# Altium schematic sheet Power+RPI_conn.SchDoc
size A3
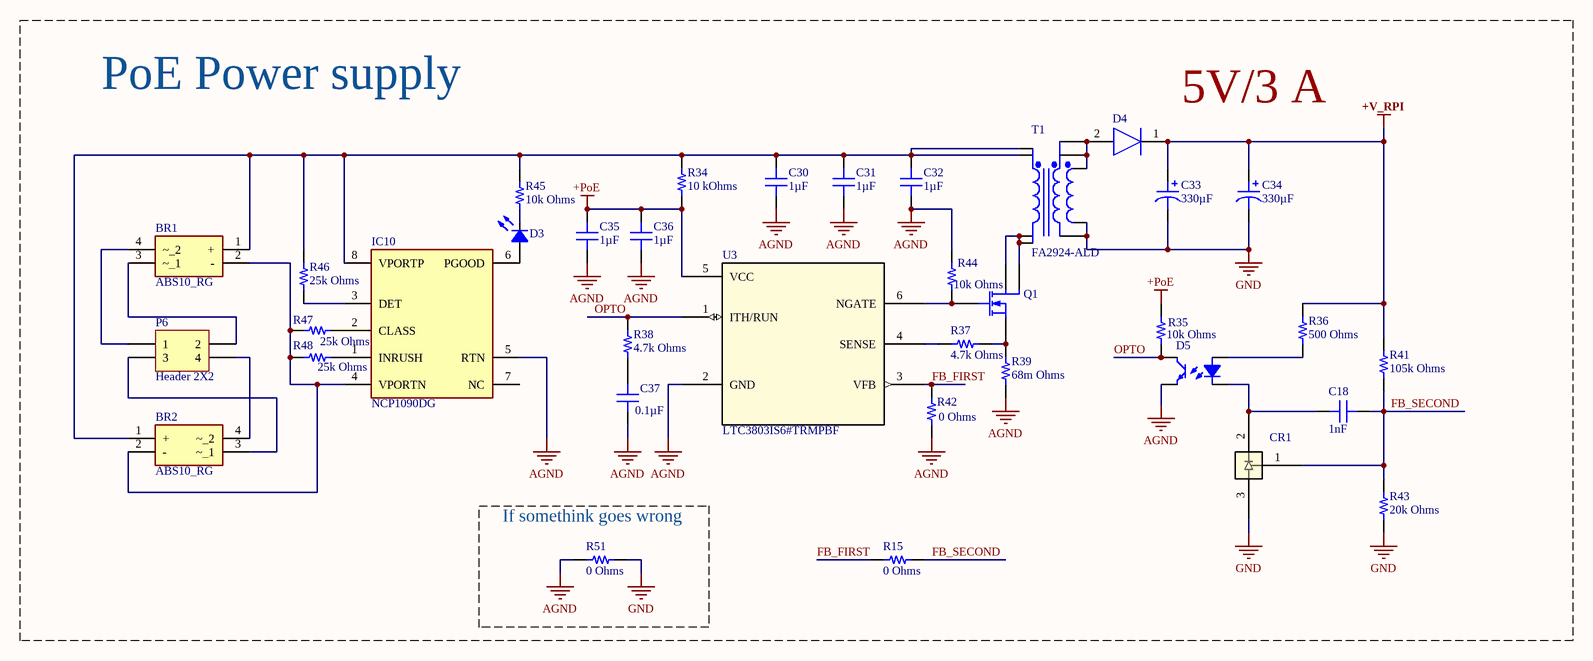
[diagram p0: Power+RPI_conn.SchDoc]

## Parts
BR1  ABS10_RG  [SOP400P645X160-4N]
BR2  ABS10_RG  [SOP400P645X160-4N]
C18  1nF  [CAP 0603_1608]
C30  1µF  [CAP 1206_3216 - 1.8MM]
C31  1µF  [CAP 1206_3216 - 1.8MM]
C32  1µF  [CAP 1206_3216 - 1.8MM]
C33  330µF  [CAP POL 2917_7343]
C34  330µF  [CAP POL 2917_7343]
C35  1µF  [CAP 1206_3216 - 1.8MM]
C36  1µF  [CAP 1206_3216 - 1.8MM]
C37  0.1µF  [CAP 0603_1608]
CR1  TLV431BFTA  [SOT23_DIO]  (value not drawn)
D3  (no value)  [LED 0603_1608 RED]
D4  SK56B_R4  [DIONM5236X261N]  (value not drawn)
D5  LTV-817S-TA1  [LITEON LTV-817]  (value not drawn)
IC10  NCP1090DG  [SOIC127P600X175-8N]
P6  Header 2X2  [HDR2X2]
Q1  IRFL4315TRPBF  [SOT230P700X180-4N]  (value not drawn)
R15  0 Ohms  [RES 2512_6432]
R34  10 kOhms  [RES 1206_3216]
R35  10k Ohms  [RES 0603_1608]
R36  500 Ohms  [RES 0603_1608]
R37  4.7k Ohms  [RES 0603_1608]
R38  4.7k Ohms  [RES 0603_1608]
R39  68m Ohms  [RES 1206_3216]
R41  105k Ohms  [RES 0603_1608]
R42  0 Ohms  [RES 0603_1608]
R43  20k Ohms  [RES 0603_1608]
R44  10k Ohms  [RES 0603_1608]
R45  10k Ohms  [RES 0603_1608]
R46  25k Ohms  [RES 0603_1608]
R47  25k Ohms  [RES 0603_1608]
R48  25k Ohms  [RES 0603_1608]
R51  0 Ohms  [RES 2512_6432]
T1  FA2924-ALD  [FA2924ALD]
U3  LTC3803IS6#TRMPBF  [SOT95P280X100-6N]

## Nets
+PoE: C35.2 C36.2 R34.1 R35.2 U3.5(VCC)
+V_RPI: C33.1 C34.1 D4.1(K) R36.2 R41.1
AGND: C30.1 C31.1 C32.1 C35.1 C36.1 C37.1 D5.3 IC10.5(RTN) R39.1 R42.2 R44.2 R51.1 U3.2(GND)
GND: C33.2 C34.2 CR1.3 R43.2 R51.2 T1.9(Sec-) T1.10(Sec-)
FB_FIRST: R15.1 R42.1 U3.3(VFB)
FB_SECOND: C18.1 CR1.1 R15.2 R41.2 R43.1
OPTO: D5.4 R35.1 R38.1 U3.1(ITH/RUN)
NetBR1_1: BR1.1(+) BR2.1(+) C30.2 C31.2 C32.2 IC10.8(VPORTP) R34.2 R45.1 R46.1 T1.1(Pri+) T1.5(Pri+)
NetBR1_2: BR1.2(-) BR2.2(-) IC10.4(VPORTN) R47.1 R48.1
NetBR1_3: BR1.3(~_1) P6.2
NetBR1_4: BR1.4(~_2) P6.1
NetBR2_3: BR2.3(~_1) P6.3
NetBR2_4: BR2.4(~_2) P6.4
NetC18_2: C18.2 CR1.2 D5.2
NetC37_2: C37.2 R38.2
NetD3_1: D3.1 IC10.6(PGOOD)
NetD3_2: D3.2 R45.2
NetD4_2: D4.2(A) T1.6(Sec+) T1.7(Sec+) T1.8(Sec+)
NetD5_1: D5.1 R36.1
NetIC10_1: IC10.1(INRUSH) R48.2
NetIC10_2: IC10.2(CLASS) R47.2
NetIC10_3: IC10.3(DET) R46.2
NetQ1_1: Q1.1(G) R44.1 U3.6(NGATE)
NetQ1_2: Q1.2(D) Q1.4(D_2) T1.2(Pri-) T1.3(Pri-)
NetQ1_3: Q1.3(S) R37.1 R39.2
NetR37_2: R37.2 U3.4(SENSE)

Not connected (* = marked no-connect by the designer): IC10 7(NC)

## Notes on the sheet
- PoE Power supply
- 5V/3 A
- (near R51) If somethink goes wrong

## Library data of the parts
BR1 BR2 = ABS10_RG: Bridge Rectifier; Manufacturer_Name: Taiwan Semiconductor; Manufacturer_Part_Number: ABS10 RG; Datasheet Link: http://210.6.198.34/ich_flag/www.taiwansemi.com/products/datasheet/ABS2 SERIES_L15.pdf; Height: 1.6mm; Arrow Part Number: ABS10 RG; Arrow Price/Stock: https://www.arrow.com/en/products/abs10rg/taiwan-semiconductor
C18 C37 = 100X14W104MV4T: CAP CER 0.1UF 10V X7R 0603; Part Number: 100X14W104MV4T
  C18: Value: 1nF
  C37: Value: 0.1µF
C30-C32 C35 C36 = C1206C105M1RACTU: CAP CER 1UF 100V X7R 1206; Manufacturer: KEMET; Tolerance: ±20%; Part Number: C1206C105M1RACTU; Value: 1µF; Applications: Bypass, Decoupling; Capacitance: 1µF; ComponentLink1Description: Datasheet; ComponentLink1URL: https://api.kemet.com/component-edge/download/datasheet/C1206C105M1RACTU.pdf; ComponentLink2Description: DigiKey Link; ComponentLink2URL: http://digikey.com/product-detail/en/kemet/C1206C105M1RACTU/399-11684-1-ND/5119827; Device Package: 1206 (3216 Metric); LastUpdated: 02/09/2020 01:05:39; Lifecycle Status: Active; Minimum Order: 1; Mounting Type: Surface Mount, MLCC; Operating Temperature: -55°C ~ 125°C; Package / Case: 1206 (3216 Metric); Packaging: TapeAndReel; PartId: 20380; Part Status: Active; Price: 0.13; Series: SMD Comm X7R; Size / Dimension: 0.126" L x 0.063" W (3.20mm x 1.60mm); Supplier 1: DigiKey; Supplier Part Number 1: 399-11684-1-ND; Temperature Coefficient: X7R; Thickness (Max): 0.071" (1.80mm); Voltage - Rated: 100V
C33 C34 = TPSE337M010R0060: CAP TANT 330UF 20% 10V 2917; Manufacturer: AVX Corporation; Manufacturer Size Code: E; ESR (Equivalent Series Resistance): 60mOhm; Type: Molded; Part Number: TPSE337M010R0060; Value: 330µF; Capacitance: 330µF; ComponentLink1Description: Datasheet; ComponentLink1URL: http://datasheets.avx.com/TPS.pdf; ComponentLink2Description: DigiKey Link; ComponentLink2URL: http://digikey.com/product-detail/en/avx-corporation/TPSE337M010R0060/478-4141-1-ND/1164477; Device Package: 2917 (7343 Metric); Features: General Purpose; Height - Seated (Max): 0.169" (4.30mm); LastUpdated: 02/09/2020 01:16:18; Lifecycle Status: Active; Minimum Order: 1; Mounting Type: Surface Mount; Operating Temperature: -55°C ~ 125°C; Package / Case: 2917 (7343 Metric); Packaging: TapeAndReel; PartId: 1652; Part Status: Active; Price: 0.94; Series: TPS; Size / Dimension: 0.287" L x 0.169" W (7.30mm x 4.30mm); Supplier 1: DigiKey; Supplier Part Number 1: 478-4141-1-ND; Tolerance: ±20%; Voltage - Rated: 10V
CR1 = TLV431BFTA: No Description Available; Vendor: Diodes Inc; Built_By: EMA_Cory; SourceLibrary: Add_to_database_2021-02-04; Type: DEV; Datasheet: https://www.diodes.com/assets/Datasheets/TLV431.pdf; Manufacturer_Part_Number: TLV431BFTA; Copyright: Copyright (C) 2018 Accelerated Designs. All rights reserved; RefDes: RefDes
D3 = 5973005507F: LED RED 0603 SMD; Part Number: 5973005507F
D4 = SK56B_R4: Diode; Manufacturer_Name: Taiwan Semiconductor; Manufacturer_Part_Number: SK56B R4; Datasheet Link: http://uk.rs-online.com/web/p/products/7435961; Height: 2.61mm; Mouser Part Number: 821-SK56BR4; Mouser Price/Stock: https://www.mouser.com/Search/Refine.aspx?Keyword=821-SK56BR4; Arrow Part Number: SK56B R4; Arrow Price/Stock: https://www.arrow.com/en/products/sk56br4/taiwan-semiconductor
D5 = LTV-817S-TA1: OPTOISOLATR 5KV TRANSISTOR 4-SMD; Manufacturer: Lite-On Inc.; Current - DC Forward (If) (Max): 50mA; Current Transfer Ratio (Max): 600% @ 5mA; Current Transfer Ratio (Min): 50% @ 5mA; Input Type: DC; Number of Channels: 1; Rise / Fall Time (Typ): 4µs, 3µs; Vce Saturation (Max): 200mV; Voltage - Forward (Vf) (Typ): 1.2V; Voltage - Isolation: 5000Vrms; Voltage - Output (Max): 35V; Part Number: LTV-817S-TA1; ComponentLink1Description: Datasheet; ComponentLink1URL: http://optoelectronics.liteon.com/upload/download/DS-70-96-0016/LTV-8X7%20series%20201610%20.pdf; ComponentLink2Description: DigiKey Link; ComponentLink2URL: http://digikey.com/product-detail/en/lite-on-inc/LTV-817S-TA1/160-1893-1-ND/3306757; Current - Output / Channel: 50mA; Device Package: 4-SMD, Gull Wing; LastUpdated: 12/01/2020 21:58:48; Lifecycle Status: Active; Minimum Order: 1; Mounting Type: Surface Mount; Operating Temperature: -30°C ~ 110°C; Output Type: Transistor; Package / Case: 4-SMD, Gull Wing; Packaging: TapeAndReel; Part Status: Active; Price: 0.12; Series: -; Supplier 1: DigiKey; Supplier Part Number 1: 160-1893-1-ND; Supplier Device Package: 4-SMD
IC10 = NCP1090DG: Integrated Circuit; Manufacturer_Name: ON Semiconductor; Datasheet Link: http://www.onsemi.com/pub/Collateral/NCP1090-D.PDF; Height: 1.75mm; Manufacturer_Part_Number: NCP1090DG; Mouser Part Number: 863-NCP1090DG; Mouser Price/Stock: https://www.mouser.com/Search/Refine.aspx?Keyword=863-NCP1090DG; Arrow Part Number: NCP1090DG; Arrow Price/Stock: https://www.arrow.com/en/products/ncp1090dg/on-semiconductor
P6 = Header 2X2: Header, 2-Pin, Dual row; LatestRevisionDate: 17-Jul-2002; LatestRevisionNote: Re-released for DXP Platform.; Publisher: Altium Limited
Q1 = IRFL4315TRPBF: MOSFET (N-Channel); Manufacturer_Name: Infineon; Datasheet Link: https://www.infineon.com/dgdl/irfl4315pbf.pdf?fileId=5546d462533600a4015356280dbc1fbe; Height: 1.8mm; Manufacturer_Part_Number: IRFL4315TRPBF; Mouser Part Number: 942-IRFL4315TRPBF; Mouser Price/Stock: https://www.mouser.co.uk/ProductDetail/Infineon-IR/IRFL4315TRPBF/?qs=9%252BKlkBgLFf2fNmu5vkaiHg%3D%3D; Arrow Part Number: IRFL4315TRPBF; Arrow Price/Stock: https://www.arrow.com/en/products/irfl4315trpbf/infineon-technologies-ag
R15 R51 = RMCF2512ZT0R00: RES 0 OHM JUMPER 1W 2512; Manufacturer: Stackpole Electronics Inc; Part Number: RMCF2512ZT0R00; ComponentLink1Description: Datasheet; ComponentLink1URL: https://www.seielect.com/catalog/sei-rmcf_rmcp.pdf; ComponentLink2Description: DigiKey Link; ComponentLink2URL: http://digikey.com/product-detail/en/stackpole-electronics-inc/RMCF2512ZT0R00/RMCF2512ZT0R00CT-ND/1942639; Composition: Thick Film; Device Package: 2512 (6432 Metric); Features: Automotive AEC-Q200; Height - Seated (Max): 0.028" (0.70mm); LastUpdated: 02/09/2020 01:27:06; Lifecycle Status: Active; Minimum Order: 1; Number of Terminations: 2; Operating Temperature: -55°C ~ 155°C; Package / Case: 2512 (6432 Metric); Packaging: TapeAndReel; Part Status: Active; Power (Watts): 1W; Price: 0.03; Ratings: AEC-Q200; Resistance: 0 Ohms; Series: RMCF; Size / Dimension: 0.248" L x 0.126" W (6.30mm x 3.20mm); Supplier 1: DigiKey; Supplier Part Number 1: RMCF2512ZT0R00CT-ND; Supplier Device Package: 2512; Tolerance: Jumper; Value: 0 Ohms
R34 = RT1206BRD0733KL: RES SMD 33K OHM 0.1% 1/4W 1206; Manufacturer: Yageo; Power (Watts): 0.25W, 1/4W; Temperature Coefficient: ±25ppm/°C; Part Number: RT1206BRD0733KL; ComponentLink1Description: Datasheet; ComponentLink1URL: https://www.yageo.com/upload/media/product/productsearch/datasheet/rchip/PYu-RT_1-to-0.01_RoHS_L_11.pdf; ComponentLink2Description: DigiKey Link; ComponentLink2URL: http://digikey.com/product-detail/en/yageo/RT1206BRD0733KL/YAG2038CT-ND/5139486; Composition: Thin Film; Device Package: 1206 (3216 Metric); Height - Seated (Max): 0.026" (0.65mm); LastUpdated: 02/09/2020 01:13:11; Lifecycle Status: Active; Minimum Order: 1; Number of Terminations: 2; Operating Temperature: -55°C ~ 155°C; Package / Case: 1206 (3216 Metric); Packaging: TapeAndReel; PartId: 26862; Part Status: Active; Price: 0.10; Resistance: 10 kOhms; Series: RT; Size / Dimension: 0.122" L x 0.063" W (3.10mm x 1.60mm); Supplier 1: DigiKey; Supplier Part Number 1: YAG2038CT-ND; Supplier Device Package: 1206; Tolerance: ±0.1%; Value: 10 kOhms
R35-R38 R41-R48 = RNCS0603BKE100R: RES 100 OHM 0.1% 1/16W 0603; Part Number: RNCS0603BKE100R
  R35 R44 R45: Value: 10k Ohms
  R36: Value: 500 Ohms
  R37 R38: Value: 4.7k Ohms
  R41: Value: 105k Ohms
  R42: Value: 0 Ohms
  R43: Value: 20k Ohms
  R46-R48: Value: 25k Ohms
R39 = URG3216L-3500-L-T05: 1206 SIZE, 0.25W, 350 OHM, 0.01%; Manufacturer: Susumu; Power (Watts): 0.25W, 1/4W; Resistance: 350 Ohms; Temperature Coefficient: ±2ppm/°C; Value: 40m Ohms; Part Number: URG3216L-3500-L-T05; ComponentLink1Description: Datasheet; ComponentLink1URL: https://www.susumu.co.jp/common/pdf/n_catalog_partition03_en.pdf; ComponentLink2Description: DigiKey Link; ComponentLink2URL: http://digikey.com/product-detail/en/susumu/URG3216L-3500-L-T05/408-2057-1-ND/9919091; Composition: Thin Film; Device Package: 1206 (3216 Metric); Features: Anti-Sulfur, Automotive AEC-Q200; Height - Seated (Max): 0.022" (0.55mm); LastUpdated: 02/09/2020 01:12:47; Lifecycle Status: Active; Minimum Order: 1; Number of Terminations: 2; Operating Temperature: -55°C ~ 155°C; Package / Case: 1206 (3216 Metric); Packaging: TapeAndReel; PartId: 36368; Part Status: Active; Price: 4.95; Ratings: AEC-Q200; Series: URG; Size / Dimension: 0.126" L x 0.063" W (3.20mm x 1.60mm); Supplier 1: DigiKey; Supplier Part Number 1: 408-2057-1-ND; Supplier Device Package: 1206; Tolerance: ±0.01%
T1 = FA2924-ALD: Transformer; Manufacturer_Name: COILCRAFT; Datasheet Link: https://www.coilcraft.com/pdfs/fa2805.pdf; Height: 12.7mm; Manufacturer_Part_Number: FA2924-ALD; Mouser Part Number: 994-FA2924-ALD; Mouser Price/Stock: https://www.mouser.co.uk/ProductDetail/Coilcraft/FA2924-ALD/?qs=ZYnrCdKdyefew%252BIVULR6AA%3D%3D
U3 = LTC3803IS6-5#TRMPBF: No Description Available; Vendor: Linear Technology; Built_By: EMA_UL_Team; SourceLibrary: LinearTech_2016-05-13_6; Manufacturer_Part_Number: LTC3803IS6-5#TRMPBF; Copyright: Copyright (C) 2018 Accelerated Designs. All rights reserved; RefDes: RefDes; Type: DEV